# EAGLE schematic TimeTracker_TestboardV1 (EAGLE 9.3.0)
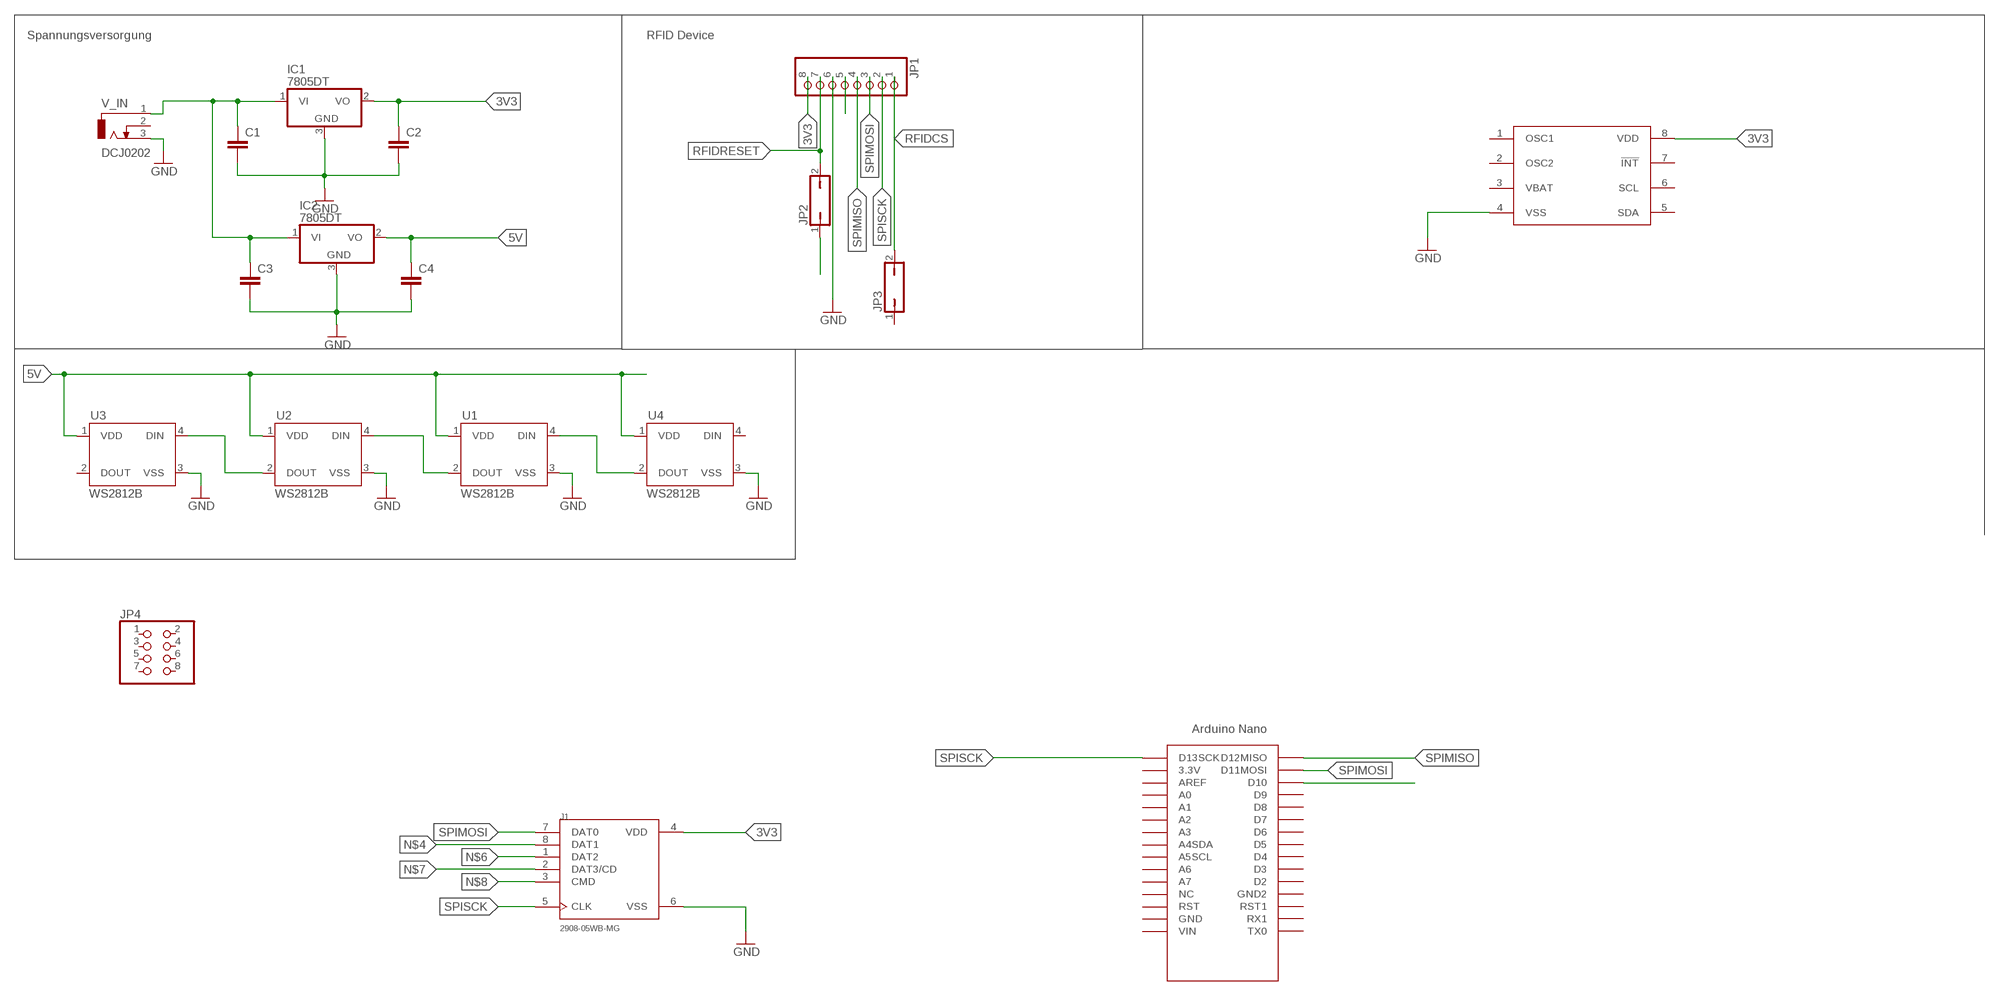
[diagram p0: schematic, sheet 1]

## Parts
C1  C-EUC0805  [C0805]
C2  C-EUC0805  [C0805]
C3  C-EUC0805  [C0805]
C4  C-EUC0805  [C0805]
IC1  7805DT  [TO252]
IC2  7805DT  [TO252]
J1  2908-05WB-MG  [3M_2908-05WB-MG]
JP1  PINHD-1X8  [1X08]
JP2  JP1Q  [JP1]
JP3  JP1Q  [JP1]
JP4  PINHD-2X4  [2X04]
U1  WS2812B  [WS2812B]
U2  WS2812B  [WS2812B]
U3  WS2812B  [WS2812B]
U4  WS2812B  [WS2812B]
U$1  NANO  [NANO]
U$2  RTC  [SOP65P490X110-8N]
V_IN  DCJ0202  [DCJ0202]

## Nets
3V3: C2.1 IC1.2(VO) J1.4(VDD) JP1.8 U$2.8(VDD)
5V: C4.1 IC2.2(VO) U1.1(VDD) U2.1(VDD) U3.1(VDD) U4.1(VDD)
GND: C1.2 C2.2 C3.2 C4.2 IC1.3(GND) IC2.3(GND) J1.6(VSS) JP1.6 U1.3(VSS) U2.3(VSS) U3.3(VSS) U4.3(VSS) U$2.4(VSS) V_IN.3
N$1: C1.1 C3.1 IC1.1(VI) IC2.1(VI) V_IN.1
N$2: JP2.1
N$3: JP1.5
N$4: J1.8(DAT1)
N$5: U$1.D10
N$6: J1.1(DAT2)
N$7: J1.2(DAT3/CD)
N$8: J1.3(CMD)
N$9: U1.4(DIN) U4.2(DOUT)
N$10: U1.2(DOUT) U2.4(DIN)
N$11: U2.2(DOUT) U3.4(DIN)
RFIDCS: JP1.1 JP3.2
RFIDRESET: JP1.7 JP2.2
SPIMISO: JP1.4 U$1.D12(D12MISO)
SPIMOSI: J1.7(DAT0) JP1.3 U$1.D11(D11MOSI)
SPISCK: J1.5(CLK) JP1.2 U$1.D13(D13SCK)
Unconnected: JP3.1 JP4.1 JP4.2 JP4.3 JP4.4 JP4.5 JP4.6 JP4.7 JP4.8 U3.2(DOUT) U4.4(DIN) U$1.3.3V U$1.5V(NC) U$1.A0 U$1.A1 U$1.A2 U$1.A3 U$1.A4(A4SDA) U$1.A5(A5SCL) U$1.A6 U$1.A7 U$1.AREF U$1.D2 U$1.D3 U$1.D4 U$1.D5 U$1.D6 U$1.D7 U$1.D8 U$1.D9 U$1.GND U$1.GND1(GND2) U$1.RAW(VIN) U$1.RST U$1.RST1 U$1.RX1 U$1.TX0 U$2.1(OSC1) U$2.2(OSC2) U$2.3(VBAT) U$2.5(SDA) U$2.6(SCL) U$2.7(!INT) V_IN.2

## Notes on the sheet
- Spannungsversorgung | RFID Device

## Library data of the parts
C1-C4 = rcl:C-EU: CAPACITOR, European symbol; SPICEPREFIX: C
IC1 IC2 = linear:78*: Positive VOLTAGE REGULATOR Source: http://cache.national.com/ds/LM/LM78L05.pdf http://www.fairchildsemi.com/ds/LM/LM7805.pdf
J1 = 2908-05WB-MG:2908-05WB-MG: 2908-05WB-MG Conn Micro S D Card HDR 8 POS 1.1mm So lder RA SMD T/R 0.5A RoHS; AVAILABILITY: Unavailable; DESCRIPTION: 2908-05WB-MG Conn Micro S D Card HDR 8 POS 1.1mm So lder RA SMD T/R 0.5A RoHS; MF: 3M; MP: 2908-05WB-MG; PACKAGE: None; PRICE: None
JP1 = pinhead:PINHD-1X8: PIN HEADER
JP2 JP3 = jumper:JP1Q: JUMPER
JP4 = pinhead:PINHD-2X4: PIN HEADER
U1-U4 = SparkFun-LED:WS2812B: WS2812B - Intelligent control LED integrated light source Technical Specifications: Power Supply Voltage (VDD): 3.5 to 5.3 V Input Voltage (VI): -0.5 to VDD+0.5 V Operating Junction Temperature (Topt): -25°C to +80°C Storage Temperature Range (Tstg): -55°C to +150°C; PROD_ID: DIO-12503
U$1 = NanoUSW:NANO: Arduino Nano
U$2 = SOP65P490X110-8N:RTC
V_IN = con-jack:DCJ0202: DC POWER JACK Source: DCJ0202.pdf; OC_FARNELL: unknown; OC_NEWARK: unknown